# Altium schematic sheet 热敏电阻schdoc.schdoc
size 127 x 99 mm
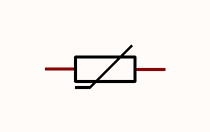
[diagram p0: 热敏电阻schdoc.schdoc]

## Parts
R?  NCP18XH103F03RB  [R0603]  (value not drawn)

## Nets

Not connected (* = marked no-connect by the designer): R? 1 2

## Library data of the parts
R? = NCP18XH103F03RB: Manufacturer: muRata(村田); Value: 10KΩ(1002); Add into BOM: yes; Resistance @ 25℃: 10kΩ; Resistance Tolerance: ±1%; B Constant (25℃/50℃): 3380K; Power: 100mW; Steady State Current (Max): 310uA; B Constant (25℃/85℃): 3334K; B Constant (25℃/100℃): 3455K; Symbol: NCP18XH103F03RB; Device: NCP18XH103F03RB; Supplier: LCSC; Manufacturer Part: NCP18XH103F03RB; Supplier Part: C13564; JLCPCB Part Class: Extended Part; LCSC Part Name: 10kΩ 电阻精度:±1% 3380K; Supplier Footprint: 0603; Convert to PCB: yes; B Constant Tolerance: ±1%; B Constant (25℃/75℃): -; Operating Temperature: -40℃~+125℃